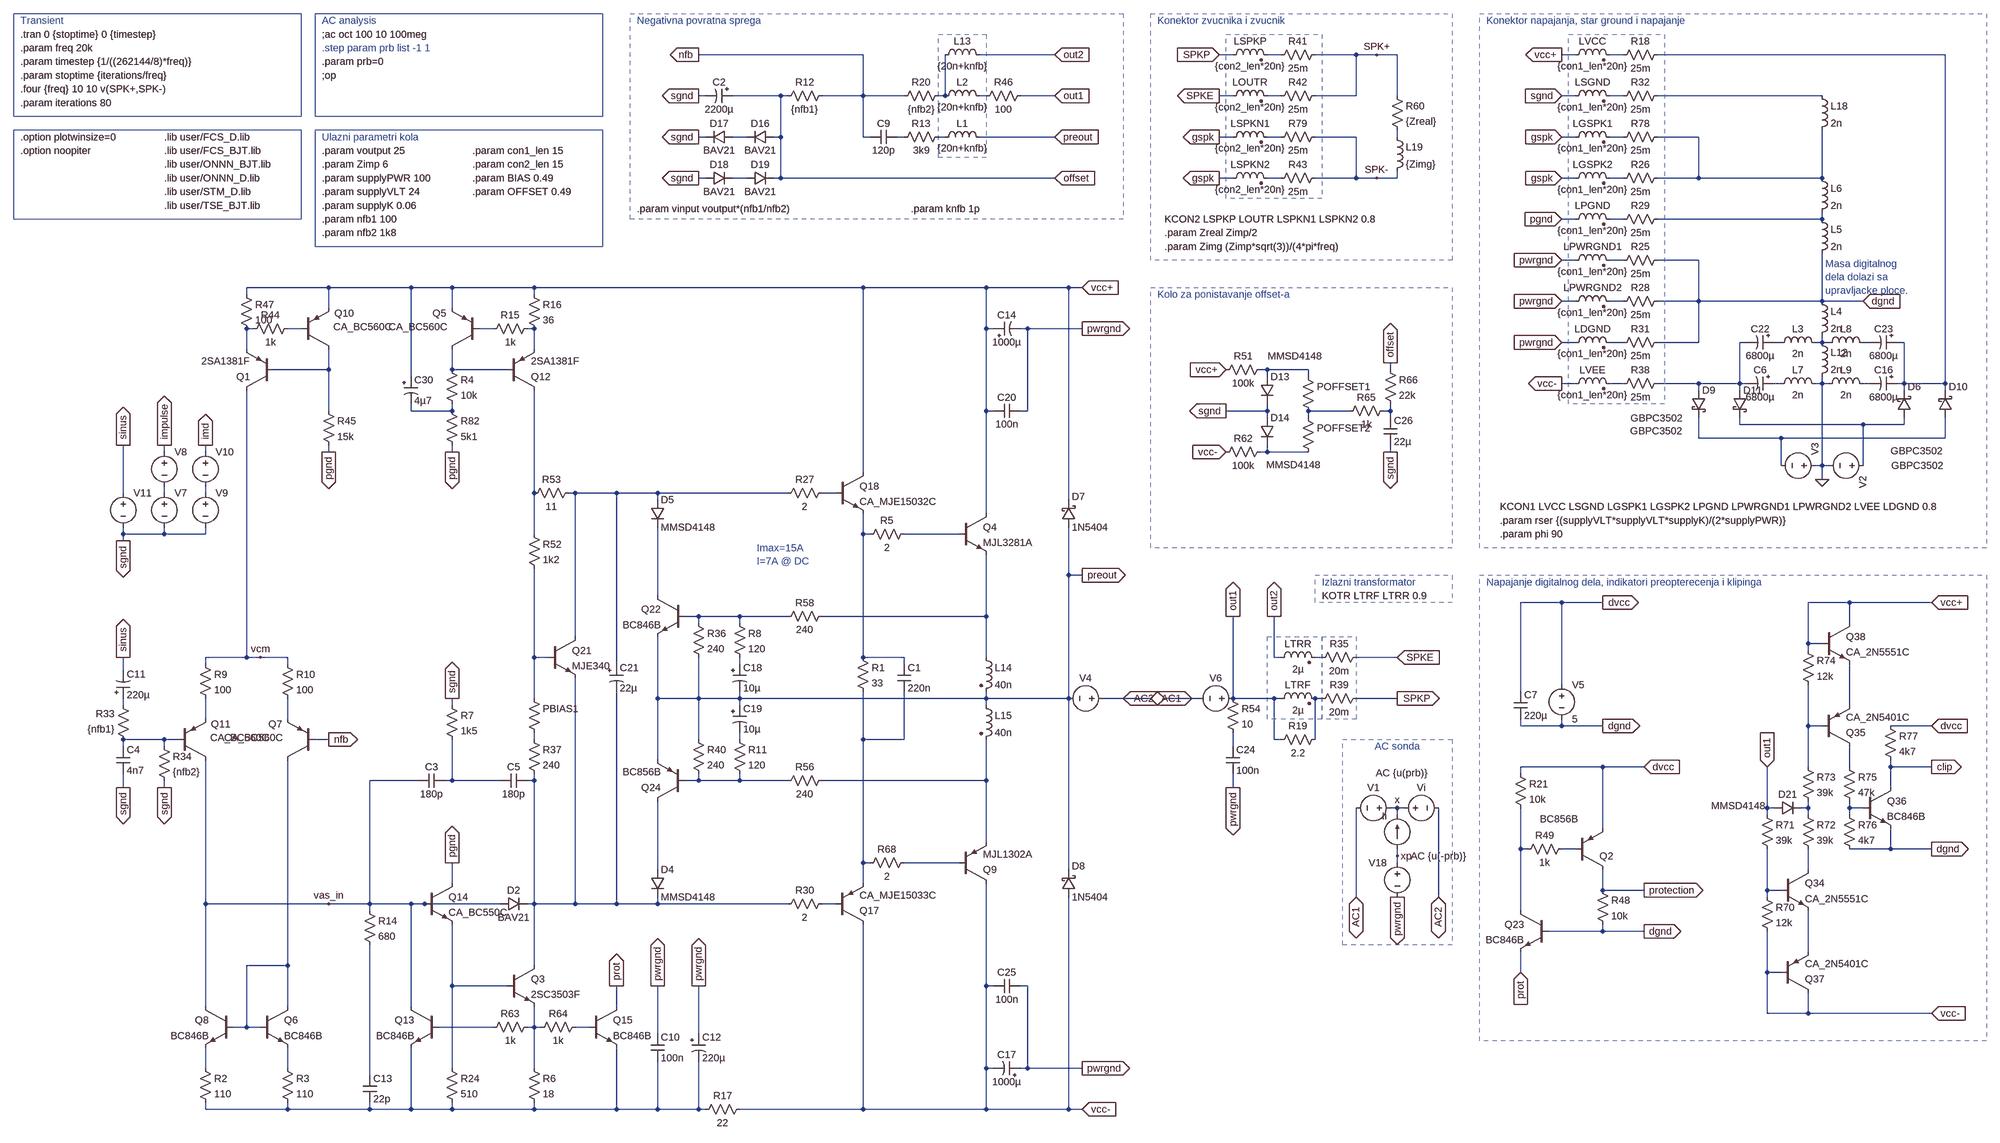
[diagram p0: schematic Arguo v2.asc]
Arguo v2.asc, the LTspice schematic file:
Version 4
SHEET 1 6124 2336
WIRE 1216 -1536 832 -1536
WIRE 1664 -1536 1488 -1536
WIRE 2080 -1536 2048 -1536
WIRE 2192 -1536 2160 -1536
WIRE 2368 -1536 2272 -1536
WIRE 2416 -1536 2368 -1536
WIRE 2464 -1536 2416 -1536
WIRE 2880 -1536 2848 -1536
WIRE 2992 -1536 2960 -1536
WIRE 3744 -1536 3072 -1536
WIRE 848 -1440 832 -1440
WIRE 1024 -1440 912 -1440
WIRE 1040 -1440 1024 -1440
WIRE 1216 -1440 1216 -1536
WIRE 1216 -1440 1120 -1440
WIRE 1312 -1440 1216 -1440
WIRE 1408 -1440 1408 -1536
WIRE 1408 -1440 1392 -1440
WIRE 1504 -1440 1488 -1440
WIRE 1664 -1440 1584 -1440
WIRE 2080 -1440 2048 -1440
WIRE 2192 -1440 2160 -1440
WIRE 2368 -1440 2368 -1536
WIRE 2368 -1440 2272 -1440
WIRE 2464 -1440 2464 -1536
WIRE 2880 -1440 2848 -1440
WIRE 2992 -1440 2960 -1440
WIRE 3456 -1440 3072 -1440
WIRE 848 -1344 832 -1344
WIRE 944 -1344 912 -1344
WIRE 1024 -1344 1024 -1440
WIRE 1024 -1344 1008 -1344
WIRE 1216 -1344 1216 -1440
WIRE 1232 -1344 1216 -1344
WIRE 1312 -1344 1296 -1344
WIRE 1408 -1344 1392 -1344
WIRE 1664 -1344 1488 -1344
WIRE 2080 -1344 2048 -1344
WIRE 2192 -1344 2160 -1344
WIRE 2368 -1344 2272 -1344
WIRE 2464 -1344 2464 -1360
WIRE 2880 -1344 2848 -1344
WIRE 2992 -1344 2960 -1344
WIRE 3168 -1344 3072 -1344
WIRE 848 -1248 832 -1248
WIRE 944 -1248 912 -1248
WIRE 1024 -1248 1024 -1344
WIRE 1024 -1248 1008 -1248
WIRE 1664 -1248 1024 -1248
WIRE 2080 -1248 2048 -1248
WIRE 2192 -1248 2160 -1248
WIRE 2368 -1248 2368 -1344
WIRE 2368 -1248 2272 -1248
WIRE 2416 -1248 2368 -1248
WIRE 2464 -1248 2464 -1264
WIRE 2464 -1248 2416 -1248
WIRE 2880 -1248 2848 -1248
WIRE 2992 -1248 2960 -1248
WIRE 3168 -1248 3168 -1344
WIRE 3168 -1248 3072 -1248
WIRE 3456 -1248 3456 -1360
WIRE 3456 -1248 3168 -1248
WIRE 2880 -1152 2848 -1152
WIRE 2992 -1152 2960 -1152
WIRE 3456 -1152 3456 -1168
WIRE 3456 -1152 3072 -1152
WIRE 2880 -1056 2848 -1056
WIRE 2992 -1056 2960 -1056
WIRE 3168 -1056 3072 -1056
WIRE -32 -992 -224 -992
WIRE 160 -992 -32 -992
WIRE 256 -992 160 -992
WIRE 448 -992 256 -992
WIRE 1216 -992 448 -992
WIRE 1344 -992 1216 -992
WIRE 1504 -992 1344 -992
WIRE 1696 -992 1504 -992
WIRE 1728 -992 1696 -992
WIRE -224 -976 -224 -992
WIRE 448 -976 448 -992
WIRE 2880 -960 2848 -960
WIRE 2992 -960 2960 -960
WIRE 3168 -960 3168 -1056
WIRE 3168 -960 3072 -960
WIRE 3456 -960 3456 -1072
WIRE 3456 -960 3168 -960
WIRE 3552 -960 3456 -960
WIRE -32 -944 -32 -992
WIRE 256 -944 256 -992
WIRE -208 -896 -224 -896
WIRE -96 -896 -128 -896
WIRE 352 -896 320 -896
WIRE 448 -896 432 -896
WIRE 1504 -896 1504 -992
WIRE 1520 -896 1504 -896
WIRE 1600 -896 1584 -896
WIRE 1728 -896 1600 -896
WIRE 2880 -864 2848 -864
WIRE 2992 -864 2960 -864
WIRE 3168 -864 3168 -960
WIRE 3168 -864 3072 -864
WIRE 3280 -864 3264 -864
WIRE 3360 -864 3344 -864
WIRE 3456 -864 3456 -880
WIRE 3456 -864 3440 -864
WIRE 3472 -864 3456 -864
WIRE 3568 -864 3552 -864
WIRE 3648 -864 3632 -864
WIRE -224 -848 -224 -896
WIRE 448 -848 448 -896
WIRE -32 -800 -32 -848
WIRE -32 -800 -160 -800
WIRE 256 -800 256 -848
WIRE 384 -800 256 -800
WIRE 2160 -800 2144 -800
WIRE 2256 -800 2160 -800
WIRE 2448 -800 2448 -816
WIRE 160 -784 160 -992
WIRE 2160 -784 2160 -800
WIRE 2256 -784 2256 -800
WIRE 2880 -768 2848 -768
WIRE 2992 -768 2960 -768
WIRE 3168 -768 3072 -768
WIRE 3264 -768 3264 -864
WIRE 3264 -768 3168 -768
WIRE 3280 -768 3264 -768
WIRE 3360 -768 3344 -768
WIRE 3456 -768 3456 -784
WIRE 3456 -768 3440 -768
WIRE 3472 -768 3456 -768
WIRE 3568 -768 3552 -768
WIRE 3648 -768 3648 -864
WIRE 3648 -768 3632 -768
WIRE 3744 -768 3744 -1536
WIRE 3744 -768 3648 -768
WIRE 3168 -752 3168 -768
WIRE 3264 -752 3264 -768
WIRE 3648 -752 3648 -768
WIRE 3744 -752 3744 -768
WIRE -32 -704 -32 -800
WIRE 160 -704 160 -720
WIRE 256 -704 256 -720
WIRE 256 -704 160 -704
WIRE 1504 -704 1504 -896
WIRE 1520 -704 1504 -704
WIRE 1600 -704 1600 -896
WIRE 1600 -704 1584 -704
WIRE 2160 -704 2160 -720
WIRE 2160 -704 2064 -704
WIRE 2352 -704 2256 -704
WIRE 2448 -704 2448 -720
WIRE 2448 -704 2432 -704
WIRE 2160 -688 2160 -704
WIRE 2256 -688 2256 -704
WIRE 2448 -688 2448 -704
WIRE 3264 -672 3264 -688
WIRE 3552 -672 3264 -672
WIRE 3648 -672 3648 -688
WIRE 3648 -672 3552 -672
WIRE 1216 -656 1216 -992
WIRE 3168 -640 3168 -688
WIRE 3360 -640 3168 -640
WIRE 3744 -640 3744 -688
WIRE 3744 -640 3360 -640
WIRE -416 -608 -416 -624
WIRE -320 -608 -320 -624
WIRE -224 -608 -224 -752
WIRE -32 -608 -32 -624
WIRE 256 -608 256 -624
WIRE 448 -608 448 -752
WIRE 2160 -608 2160 -624
WIRE 2160 -608 2144 -608
WIRE 2256 -608 2160 -608
WIRE 2448 -608 2448 -624
WIRE 3360 -576 3360 -640
WIRE 3456 -576 3456 -768
WIRE 3456 -576 3440 -576
WIRE 3472 -576 3456 -576
WIRE 3552 -576 3552 -672
WIRE 1216 -560 1216 -656
WIRE 3456 -544 3456 -576
WIRE -512 -512 -512 -624
WIRE -416 -512 -416 -528
WIRE -320 -512 -320 -528
WIRE 448 -512 448 -608
WIRE 544 -512 528 -512
WIRE 640 -512 544 -512
WIRE 736 -512 640 -512
WIRE 1040 -512 736 -512
WIRE 1152 -512 1120 -512
WIRE 736 -496 736 -512
WIRE 1696 -496 1696 -992
WIRE 1504 -464 1504 -704
WIRE -512 -416 -512 -432
WIRE -416 -416 -416 -432
WIRE -416 -416 -512 -416
WIRE -320 -416 -320 -432
WIRE -320 -416 -416 -416
WIRE 448 -416 448 -512
WIRE 1216 -416 1216 -464
WIRE 1232 -416 1216 -416
WIRE 1440 -416 1312 -416
WIRE -512 -400 -512 -416
WIRE 1696 -320 1696 -432
WIRE 1728 -320 1696 -320
WIRE 736 -272 736 -432
WIRE 2800 -256 2752 -256
WIRE 2848 -256 2800 -256
WIRE 2944 -256 2848 -256
WIRE 3520 -256 3424 -256
WIRE 3712 -256 3520 -256
WIRE 832 -224 800 -224
WIRE 928 -224 832 -224
WIRE 1040 -224 928 -224
WIRE 1504 -224 1504 -368
WIRE 1504 -224 1120 -224
WIRE 832 -208 832 -224
WIRE 928 -208 928 -224
WIRE 3520 -208 3520 -256
WIRE 544 -176 544 -512
WIRE 3424 -160 3424 -256
WIRE 3456 -160 3424 -160
WIRE 3424 -144 3424 -160
WIRE -224 -128 -224 -608
WIRE -224 -128 -320 -128
WIRE -192 -128 -224 -128
WIRE -128 -128 -192 -128
WIRE 448 -128 448 -336
WIRE 480 -128 448 -128
WIRE 1216 -128 1216 -416
WIRE 1312 -128 1216 -128
WIRE 1504 -128 1504 -224
WIRE 2176 -128 2176 -224
WIRE 2192 -128 2176 -128
WIRE 2288 -128 2272 -128
WIRE 2464 -128 2368 -128
WIRE -320 -112 -320 -128
WIRE -128 -112 -128 -128
WIRE 640 -112 640 -512
WIRE 928 -112 928 -128
WIRE 1312 -112 1312 -128
WIRE -512 -96 -512 -128
WIRE 2848 -64 2848 -256
WIRE 2752 -48 2752 -256
WIRE 448 -32 448 -128
WIRE 736 -32 736 -176
WIRE 832 -32 832 -128
WIRE 832 -32 736 -32
WIRE 928 -32 928 -48
WIRE 928 -32 832 -32
WIRE 1504 -32 1504 -48
WIRE 1504 -32 928 -32
WIRE 1632 -32 1504 -32
WIRE 1696 -32 1696 -320
WIRE 1696 -32 1632 -32
WIRE 1888 -32 1776 -32
WIRE 2000 -32 1920 -32
WIRE 2080 -32 2080 -224
WIRE 2176 -32 2080 -32
WIRE 2192 -32 2176 -32
WIRE 2288 -32 2272 -32
WIRE 2464 -32 2368 -32
WIRE -512 -16 -512 -32
WIRE 256 -16 256 -32
WIRE 928 -16 928 -32
WIRE 1504 -16 1504 -32
WIRE 3520 -16 3520 -112
WIRE -320 16 -320 -32
WIRE -128 16 -128 -32
WIRE 2752 32 2752 16
WIRE 2848 32 2848 16
WIRE 2848 32 2752 32
WIRE 2944 32 2848 32
WIRE 3424 32 3424 -64
WIRE 3456 32 3424 32
WIRE 3712 32 3616 32
WIRE -416 64 -512 64
WIRE -384 64 -416 64
WIRE -32 64 -64 64
WIRE 448 64 448 48
WIRE 832 64 832 -32
WIRE 928 64 928 48
WIRE 1216 64 1216 -48
WIRE 1312 64 1312 -48
WIRE 1312 64 1216 64
WIRE 2176 64 2176 -32
WIRE 2192 64 2176 64
WIRE 2272 64 2272 -32
WIRE -512 80 -512 64
WIRE -416 80 -416 64
WIRE 2080 80 2080 48
WIRE 736 112 736 -32
WIRE 2944 128 2752 128
WIRE 3040 128 2944 128
WIRE 3424 128 3424 32
WIRE 3520 128 3520 80
WIRE 3616 128 3616 112
WIRE 3712 128 3616 128
WIRE 2752 144 2752 128
WIRE 176 160 64 160
WIRE 256 160 256 64
WIRE 256 160 240 160
WIRE 368 160 256 160
WIRE 448 160 448 144
WIRE 448 160 432 160
WIRE 832 160 832 144
WIRE 832 160 800 160
WIRE 928 160 928 144
WIRE 928 160 832 160
WIRE 1040 160 928 160
WIRE 1504 160 1504 64
WIRE 1504 160 1120 160
WIRE -512 176 -512 144
WIRE -416 176 -416 160
WIRE 2080 176 2080 144
WIRE 3616 176 3616 128
WIRE 2464 224 2448 224
WIRE 2480 224 2464 224
WIRE 3328 224 3328 128
WIRE 3344 224 3328 224
WIRE 3424 224 3424 208
WIRE 3424 224 3408 224
WIRE 3520 224 3520 208
WIRE 3552 224 3520 224
WIRE 2464 240 2464 224
WIRE 3328 240 3328 224
WIRE 3424 240 3424 224
WIRE 3520 240 3520 224
WIRE 2944 272 2944 128
WIRE 1504 304 1504 160
WIRE 2752 320 2752 224
WIRE 2768 320 2752 320
WIRE 2880 320 2848 320
WIRE 3616 320 3616 272
WIRE 3616 320 3520 320
WIRE 3712 320 3616 320
WIRE 2464 336 2464 320
WIRE 1216 352 1216 64
WIRE 1232 352 1216 352
WIRE 1440 352 1312 352
WIRE 2464 352 2464 336
WIRE 736 368 736 208
WIRE 1696 368 1696 -32
WIRE 3424 368 3424 320
WIRE 256 400 256 352
WIRE 1216 400 1216 352
WIRE 2944 416 2944 368
WIRE 3040 416 2944 416
WIRE 3328 416 3328 320
WIRE 3360 416 3328 416
WIRE 2368 432 2368 224
WIRE 2560 432 2560 224
WIRE 3328 432 3328 416
WIRE -320 448 -320 112
WIRE -32 448 -320 448
WIRE 64 448 64 160
WIRE 64 448 -32 448
WIRE 160 448 64 448
WIRE 192 448 160 448
WIRE 368 448 192 448
WIRE 448 448 448 160
WIRE 448 448 432 448
WIRE 544 448 544 -80
WIRE 544 448 448 448
WIRE 640 448 640 -48
WIRE 640 448 544 448
WIRE 736 448 736 432
WIRE 736 448 640 448
WIRE 1040 448 736 448
WIRE 1152 448 1120 448
WIRE 64 464 64 448
WIRE 2752 464 2752 320
WIRE 2944 512 2944 496
WIRE 2944 512 2816 512
WIRE 3040 512 2944 512
WIRE 3424 560 3424 464
WIRE -128 592 -128 112
WIRE -128 592 -224 592
WIRE 448 592 448 448
WIRE 2752 608 2752 560
WIRE 3328 608 3328 512
WIRE 3360 608 3328 608
WIRE 256 640 256 496
WIRE 384 640 256 640
WIRE 1504 640 1504 400
WIRE 1520 640 1504 640
WIRE 1600 640 1584 640
WIRE -320 688 -320 448
WIRE -128 688 -128 592
WIRE 160 688 160 448
WIRE 640 688 640 640
WIRE 3328 704 3328 608
WIRE 3424 704 3424 656
WIRE 3424 704 3328 704
WIRE 3712 704 3424 704
WIRE -224 736 -224 592
WIRE -224 736 -256 736
WIRE -192 736 -224 736
WIRE 352 736 224 736
WIRE 448 736 448 688
WIRE 448 736 432 736
WIRE 464 736 448 736
WIRE 576 736 544 736
WIRE 736 752 736 640
WIRE 832 752 832 640
WIRE -320 832 -320 784
WIRE -128 832 -128 784
WIRE 256 832 256 640
WIRE 448 832 448 736
WIRE 1504 832 1504 640
WIRE 1520 832 1504 832
WIRE 1600 832 1600 640
WIRE 1600 832 1584 832
WIRE 1728 832 1600 832
WIRE 64 848 64 544
WIRE -320 928 -320 912
WIRE -128 928 -128 912
WIRE -128 928 -320 928
WIRE 64 928 64 912
WIRE 64 928 -128 928
WIRE 160 928 160 784
WIRE 160 928 64 928
WIRE 256 928 256 912
WIRE 256 928 160 928
WIRE 448 928 448 912
WIRE 448 928 256 928
WIRE 640 928 640 784
WIRE 640 928 448 928
WIRE 736 928 736 816
WIRE 736 928 640 928
WIRE 832 928 832 816
WIRE 832 928 736 928
WIRE 848 928 832 928
WIRE 1216 928 1216 496
WIRE 1216 928 928 928
WIRE 1344 928 1216 928
WIRE 1504 928 1504 832
WIRE 1504 928 1344 928
WIRE 1696 928 1696 432
WIRE 1696 928 1504 928
WIRE 1728 928 1696 928
FLAG 1728 -992 vcc+
IOPIN 1728 -992 In
FLAG 2464 224 x
FLAG 1728 928 vcc-
IOPIN 1728 928 In
FLAG 2080 -224 out1
IOPIN 2080 -224 Out
FLAG 832 -1536 nfb
IOPIN 832 -1536 Out
FLAG -32 64 nfb
IOPIN -32 64 Out
FLAG 2464 336 xp
FLAG 2080 176 pwrgnd
IOPIN 2080 176 Out
FLAG -512 176 sgnd
IOPIN -512 176 Out
FLAG -416 176 sgnd
IOPIN -416 176 Out
FLAG 832 -1440 sgnd
IOPIN 832 -1440 Out
FLAG 1728 -896 pwrgnd
IOPIN 1728 -896 Out
FLAG 2752 608 prot
IOPIN 2752 608 In
FLAG 3040 512 dgnd
IOPIN 3040 512 Out
FLAG 3040 128 dvcc
IOPIN 3040 128 In
FLAG 3040 416 protection
IOPIN 3040 416 Out
FLAG 1728 -320 preout
IOPIN 1728 -320 Out
FLAG -192 -128 vcm
FLAG 832 -1344 sgnd
IOPIN 832 -1344 Out
FLAG 832 -1248 sgnd
IOPIN 832 -1248 Out
FLAG 2176 -224 out2
IOPIN 2176 -224 Out
FLAG 3712 128 clip
IOPIN 3712 128 Out
FLAG 3712 320 dgnd
IOPIN 3712 320 Out
FLAG 3712 32 dvcc
IOPIN 3712 32 In
FLAG -512 -400 sgnd
IOPIN -512 -400 Out
FLAG -512 -624 sinus
IOPIN -512 -624 Out
FLAG 640 640 prot
IOPIN 640 640 Out
FLAG 832 640 pwrgnd
IOPIN 832 640 Out
FLAG 256 352 pgnd
IOPIN 256 352 Out
FLAG -32 -608 pgnd
IOPIN -32 -608 Out
FLAG 256 -608 pgnd
IOPIN 256 -608 Out
FLAG 1728 832 pwrgnd
IOPIN 1728 832 Out
FLAG 2848 -1536 vcc+
IOPIN 2848 -1536 Out
FLAG 2848 -768 vcc-
IOPIN 2848 -768 Out
FLAG 2848 -1248 gspk
IOPIN 2848 -1248 In
FLAG 2848 -960 pwrgnd
IOPIN 2848 -960 In
FLAG 2848 -1152 pgnd
IOPIN 2848 -1152 In
FLAG 2848 -1440 sgnd
IOPIN 2848 -1440 In
FLAG 1664 -1440 out1
IOPIN 1664 -1440 In
FLAG 1664 -1536 out2
IOPIN 1664 -1536 In
FLAG 2464 -32 SPKP
IOPIN 2464 -32 Out
FLAG 2048 -1248 gspk
IOPIN 2048 -1248 Out
FLAG 2048 -1536 SPKP
IOPIN 2048 -1536 In
FLAG 2048 -1440 SPKE
IOPIN 2048 -1440 Out
FLAG 3328 128 out1
IOPIN 3328 128 In
FLAG 3552 -960 dgnd
IOPIN 3552 -960 In
FLAG 3712 704 vcc-
IOPIN 3712 704 In
FLAG 3712 -256 vcc+
IOPIN 3712 -256 In
FLAG 2944 -256 dvcc
IOPIN 2944 -256 Out
FLAG 2944 32 dgnd
IOPIN 2944 32 Out
FLAG 2848 -1056 pwrgnd
IOPIN 2848 -1056 In
FLAG 736 640 pwrgnd
IOPIN 736 640 Out
FLAG -416 -624 impulse
IOPIN -416 -624 Out
FLAG 2848 -864 pwrgnd
IOPIN 2848 -864 In
FLAG 3456 -544 0
FLAG 2064 -800 vcc+
IOPIN 2064 -800 In
FLAG 2064 -608 vcc-
IOPIN 2064 -608 In
FLAG 2064 -704 sgnd
IOPIN 2064 -704 Out
FLAG 2448 -608 sgnd
IOPIN 2448 -608 Out
FLAG 2448 -816 offset
IOPIN 2448 -816 Out
FLAG 1664 -1248 offset
IOPIN 1664 -1248 In
FLAG 2368 432 AC1
IOPIN 2368 432 BiDir
FLAG 2560 432 AC2
IOPIN 2560 432 BiDir
FLAG 1888 -32 AC1
IOPIN 1888 -32 BiDir
FLAG 1920 -32 AC2
IOPIN 1920 -32 BiDir
FLAG 2464 432 pwrgnd
IOPIN 2464 432 Out
FLAG 2416 -1536 SPK+
FLAG 2416 -1248 SPK-
FLAG 2464 -128 SPKE
IOPIN 2464 -128 In
FLAG 2848 -1344 gspk
IOPIN 2848 -1344 In
FLAG 2048 -1344 gspk
IOPIN 2048 -1344 Out
FLAG -320 -624 imd
IOPIN -320 -624 Out
FLAG 256 -32 sgnd
IOPIN 256 -32 Out
FLAG 1664 -1344 preout
IOPIN 1664 -1344 In
FLAG -32 448 vas_in
FLAG -512 -128 sinus
IOPIN -512 -128 Out
DATAFLAG 448 -608 "-Ic(Q12)"
DATAFLAG 2800 -256 ""
DATAFLAG 1504 -32 ""
DATAFLAG 1344 -992 ""
DATAFLAG 1344 928 ""
DATAFLAG 1216 -656 "Ic(Q18)"
DATAFLAG -224 -608 "-Ic(Q1)"
DATAFLAG 1632 -32 ""
SYMBOL res 1136 -1456 R90
WINDOW 0 0 56 VBottom 2
WINDOW 3 32 56 VTop 2
SYMATTR InstName R12
SYMATTR Value {nfb1}
SYMBOL voltage 3568 -576 R90
WINDOW 123 0 0 Left 2
WINDOW 3 -94 177 Invisible 2
SYMATTR Value SINE(0 {supplyVLT*sqrt(2)} 50 0 0 {phi})
SYMATTR SpiceLine Rser={rser}
SYMATTR InstName V2
SYMBOL current 2464 320 R180
WINDOW 0 24 77 Left 2
WINDOW 3 24 0 Invisible 2
WINDOW 123 -71 178 Left 2
WINDOW 39 0 0 Left 2
SYMATTR InstName Ii
SYMATTR Value 0
SYMATTR Value2 AC {u(prb)}
SYMBOL voltage 2464 224 R270
WINDOW 0 32 56 VTop 2
WINDOW 3 -32 56 Invisible 2
WINDOW 123 -97 96 VBottom 2
WINDOW 39 -32 56 VBottom 2
SYMATTR InstName Vi
SYMATTR Value 0
SYMATTR Value2 AC {u(-prb)}
SYMBOL pnp -384 112 M180
WINDOW 0 77 84 Left 2
WINDOW 3 75 52 Left 2
SYMATTR InstName Q11
SYMATTR Value CA_BC560C
SYMBOL res -496 80 R180
WINDOW 0 36 76 Left 2
WINDOW 3 36 40 Left 2
SYMATTR InstName R33
SYMATTR Value {nfb1}
SYMBOL res -432 64 R0
SYMATTR InstName R34
SYMATTR Value {nfb2}
SYMBOL res -336 816 R0
SYMATTR InstName R2
SYMATTR Value 110
SYMBOL res -144 816 R0
SYMATTR InstName R3
SYMATTR Value 110
SYMBOL res -336 -128 R0
SYMATTR InstName R9
SYMATTR Value 100
SYMBOL res -144 -128 R0
SYMATTR InstName R10
SYMATTR Value 100
SYMBOL res 432 -992 R0
SYMATTR InstName R16
SYMATTR Value 36
SYMBOL pnp 384 -752 M180
SYMATTR InstName Q12
SYMATTR Value 2SA1381F
SYMBOL schottky 1680 -432 M180
WINDOW 0 24 72 Left 2
WINDOW 3 24 0 Left 2
SYMATTR InstName D7
SYMATTR Value 1N5404
SYMATTR Description Diode
SYMATTR Type diode
SYMBOL schottky 1680 432 M180
WINDOW 0 24 72 Left 2
WINDOW 3 24 0 Left 2
SYMATTR InstName D8
SYMATTR Value 1N5404
SYMATTR Description Diode
SYMATTR Type diode
SYMBOL ind2 2176 -16 R270
WINDOW 0 32 56 VTop 2
WINDOW 3 4 56 VBottom 2
SYMATTR InstName LTRF
SYMATTR Value 2µ
SYMATTR SpiceLine Rser=10m Rpar=3meg Cpar=1p
SYMATTR Type ind
SYMBOL res 2176 80 R270
WINDOW 0 32 56 VTop 2
WINDOW 3 0 56 VBottom 2
SYMATTR InstName R19
SYMATTR Value 2.2
SYMBOL res 1408 -1456 R90
WINDOW 0 0 56 VBottom 2
WINDOW 3 32 56 VTop 2
SYMATTR InstName R20
SYMATTR Value {nfb2}
SYMBOL voltage 2464 224 R90
WINDOW 0 -32 56 VBottom 2
WINDOW 3 32 56 Invisible 2
WINDOW 123 0 0 Left 2
WINDOW 39 0 0 Left 2
SYMATTR InstName V1
SYMATTR Value 0
SYMBOL schottky 3632 -688 M180
WINDOW 0 24 72 Left 2
WINDOW 3 -14 -112 Left 2
SYMATTR InstName D6
SYMATTR Value GBPC3502
SYMATTR Description Diode
SYMATTR Type diode
SYMBOL schottky 3152 -752 R0
WINDOW 3 -144 95 Left 2
SYMATTR Value GBPC3502
SYMATTR InstName D9
SYMATTR Description Diode
SYMATTR Type diode
SYMBOL voltage 3456 -576 M270
WINDOW 123 0 0 Left 2
WINDOW 3 -96 -62 Invisible 2
SYMATTR Value SINE(0 {supplyVLT*sqrt(2)} 50 0 0 {phi})
SYMATTR SpiceLine Rser={rser}
SYMATTR InstName V3
SYMBOL res 2064 -48 R0
SYMATTR InstName R54
SYMATTR Value 10
SYMBOL res 2448 -1456 R0
SYMATTR InstName R60
SYMATTR Value {Zreal}
SYMBOL ind 2448 -1360 R0
SYMATTR InstName L19
SYMATTR Value {Zimg}
SYMATTR SpiceLine Cpar=10p
SYMBOL voltage 2464 336 M0
WINDOW 123 0 0 Left 2
WINDOW 39 0 0 Left 2
WINDOW 3 24 96 Invisible 2
SYMATTR Value 0
SYMATTR InstName V18
SYMBOL pnp 1152 496 M180
SYMATTR InstName Q17
SYMATTR Value CA_MJE15033C
SYMBOL npn 1152 -560 R0
SYMATTR InstName Q18
SYMATTR Value CA_MJE15032C
SYMBOL cap 1520 -720 M90
WINDOW 0 0 32 VBottom 2
WINDOW 3 32 32 VTop 2
SYMATTR InstName C20
SYMATTR Value 100n
SYMATTR SpiceLine Rser=700m Lser=7n Rpar=4.4meg Cpar=1p
SYMBOL res 1136 -528 R90
WINDOW 0 0 56 VBottom 2
WINDOW 3 32 56 VTop 2
SYMATTR InstName R27
SYMATTR Value 2
SYMBOL res 1136 432 R90
WINDOW 0 0 56 VBottom 2
WINDOW 3 32 56 VTop 2
SYMATTR InstName R30
SYMATTR Value 2
SYMBOL res 240 816 R0
SYMATTR InstName R24
SYMATTR Value 510
SYMBOL cap 2064 80 R0
SYMATTR InstName C24
SYMATTR Value 100n
SYMATTR SpiceLine Rser=700m Lser=7n Rpar=4.4meg Cpar=1p
SYMBOL cap 1584 624 R90
WINDOW 0 0 32 VBottom 2
WINDOW 3 32 32 VTop 2
SYMATTR InstName C25
SYMATTR Value 100n
SYMATTR SpiceLine Rser=700m Lser=7n Rpar=4.4meg Cpar=1p
SYMBOL polcap 912 -1456 R90
WINDOW 0 0 32 VBottom 2
WINDOW 3 32 32 VTop 2
SYMATTR InstName C2
SYMATTR Value 2200µ
SYMATTR SpiceLine V=6.3 Irms=1.44 Rser=0.09 Lser=5.5n Rpar=110k Cpar=3p mfg="Nichicon" pn="UPW0J222MPD6TD" type="Al electrolytic"
SYMATTR Description Capacitor
SYMATTR Type cap
SYMBOL polcap 3344 -784 R90
WINDOW 0 0 32 VBottom 2
WINDOW 3 32 32 VTop 2
SYMATTR InstName C6
SYMATTR Value 6800µ
SYMATTR SpiceLine V=50 Irms=2.5 Rser=0.08 Lser=20n Rpar=40k Cpar=3p mfg="Nichicon" pn="UVZ1H682MRD" type="Al electrolytic"
SYMATTR Description Capacitor
SYMATTR Type cap
SYMBOL res 2736 128 R0
SYMATTR InstName R21
SYMATTR Value 10k
SYMBOL npn 2816 464 M0
SYMATTR InstName Q23
SYMATTR Value BC846B
SYMBOL res -240 -992 R0
SYMATTR InstName R47
SYMATTR Value 100
SYMBOL pnp 2880 368 M180
WINDOW 3 -83 118 Left 2
SYMATTR Value BC856B
SYMATTR InstName Q2
SYMBOL res 2928 400 R0
SYMATTR InstName R48
SYMATTR Value 10k
SYMBOL res 2864 304 R90
WINDOW 0 0 56 VBottom 2
WINDOW 3 32 56 VTop 2
SYMATTR InstName R49
SYMATTR Value 1k
SYMBOL res 432 -48 R0
WINDOW 3 36 76 Invisible 2
SYMATTR Value {1+(500*BIAS)}
SYMATTR InstName PBIAS1
SYMBOL res 432 -432 R0
SYMATTR InstName R52
SYMATTR Value 1k2
SYMBOL res 544 -528 R90
WINDOW 0 0 56 VBottom 2
WINDOW 3 32 56 VTop 2
SYMATTR InstName R53
SYMATTR Value 11
SYMBOL schottky 3728 -688 M180
WINDOW 0 24 72 Left 2
WINDOW 3 -112 -78 Left 2
SYMATTR InstName D10
SYMATTR Value GBPC3502
SYMATTR Description Diode
SYMATTR Type diode
SYMBOL schottky 3248 -752 R0
WINDOW 3 -239 65 Left 2
SYMATTR Value GBPC3502
SYMATTR InstName D11
SYMATTR Description Diode
SYMATTR Type diode
SYMBOL ind2 2864 -1520 R270
WINDOW 0 32 56 VTop 2
WINDOW 3 5 56 VBottom 2
SYMATTR InstName LVCC
SYMATTR Value {con1_len*20n}
SYMATTR SpiceLine Rser={con1_len*.5m}
SYMATTR Type ind
SYMBOL ind2 2864 -752 R270
WINDOW 0 32 56 VTop 2
WINDOW 3 5 56 VBottom 2
SYMATTR InstName LVEE
SYMATTR Value {con1_len*20n}
SYMATTR SpiceLine Rser={con1_len*.5m}
SYMATTR Type ind
SYMBOL diode 368 464 R270
WINDOW 0 32 32 VTop 2
WINDOW 3 0 32 VBottom 2
SYMATTR InstName D2
SYMATTR Value BAV21
SYMBOL diode 1008 -1360 R90
WINDOW 0 0 32 VBottom 2
WINDOW 3 32 32 VTop 2
SYMATTR InstName D16
SYMATTR Value BAV21
SYMBOL diode 912 -1360 R90
WINDOW 0 0 32 VBottom 2
WINDOW 3 32 32 VTop 2
SYMATTR InstName D17
SYMATTR Value BAV21
SYMBOL diode 848 -1232 R270
WINDOW 0 32 32 VTop 2
WINDOW 3 0 32 VBottom 2
SYMATTR InstName D18
SYMATTR Value BAV21
SYMBOL diode 944 -1232 R270
WINDOW 0 32 32 VTop 2
WINDOW 3 0 32 VBottom 2
SYMATTR InstName D19
SYMATTR Value BAV21
SYMBOL res 1600 -1456 R90
WINDOW 0 0 56 VBottom 2
WINDOW 3 32 56 VTop 2
SYMATTR InstName R46
SYMATTR Value 100
SYMBOL ind2 2176 -112 R270
WINDOW 0 32 56 VTop 2
WINDOW 3 4 56 VBottom 2
SYMATTR InstName LTRR
SYMATTR Value 2µ
SYMATTR SpiceLine Rser=80m Rpar=3meg Cpar=1p
SYMATTR Type ind
SYMBOL npn 3360 368 R0
SYMATTR InstName Q34
SYMATTR Value CA_2N5551C
SYMBOL res 3312 416 R0
SYMATTR InstName R70
SYMATTR Value 12k
SYMBOL res 3312 224 R0
SYMATTR InstName R71
SYMATTR Value 39k
SYMBOL res 3408 224 R0
SYMATTR InstName R72
SYMATTR Value 39k
SYMBOL diode 3344 240 R270
WINDOW 0 32 32 VTop 2
WINDOW 3 37 -83 VBottom 2
SYMATTR InstName D21
SYMATTR Value MMSD4148
SYMBOL res 3408 112 R0
SYMATTR InstName R73
SYMATTR Value 39k
SYMBOL res 3408 -160 R0
SYMATTR InstName R74
SYMATTR Value 12k
SYMBOL pnp 3456 80 M180
SYMATTR InstName Q35
SYMATTR Value CA_2N5401C
SYMBOL res 3504 112 R0
SYMATTR InstName R75
SYMATTR Value 47k
SYMBOL npn 3552 176 R0
SYMATTR InstName Q36
SYMATTR Value BC846B
SYMBOL res 3504 224 R0
SYMATTR InstName R76
SYMATTR Value 4k7
SYMBOL res 3600 16 R0
SYMATTR InstName R77
SYMATTR Value 4k7
SYMBOL pnp 3360 656 M180
SYMATTR InstName Q37
SYMATTR Value CA_2N5401C
SYMBOL npn 3456 -208 R0
SYMATTR InstName Q38
SYMATTR Value CA_2N5551C
SYMBOL npn 384 592 R0
SYMATTR InstName Q3
SYMATTR Value 2SC3503F
SYMBOL res 432 816 R0
SYMATTR InstName R6
SYMATTR Value 18
SYMBOL cap -528 144 M180
WINDOW 0 24 56 Left 2
WINDOW 3 24 8 Left 2
SYMATTR InstName C4
SYMATTR Value 4n7
SYMBOL voltage -512 -528 R0
WINDOW 123 24 44 Left 2
WINDOW 39 0 0 Left 2
WINDOW 3 24 96 Invisible 2
SYMATTR Value SINE(0 {vinput} {freq})
SYMATTR InstName V11
SYMBOL npn 224 688 M0
SYMATTR InstName Q13
SYMATTR Value BC846B
SYMBOL res 448 720 R90
WINDOW 0 0 56 VBottom 2
WINDOW 3 32 56 VTop 2
SYMATTR InstName R63
SYMATTR Value 1k
SYMBOL res 560 720 R90
WINDOW 0 0 56 VBottom 2
WINDOW 3 32 56 VTop 2
SYMATTR InstName R64
SYMATTR Value 1k
SYMBOL res 240 -816 R0
SYMATTR InstName R4
SYMATTR Value 10k
SYMBOL res 1200 -144 R0
SYMATTR InstName R1
SYMATTR Value 33
SYMBOL pnp -160 -752 R180
SYMATTR InstName Q1
SYMATTR Value 2SA1381F
SYMBOL pnp -64 112 R180
WINDOW 0 77 84 Left 2
WINDOW 3 75 52 Left 2
SYMATTR InstName Q7
SYMATTR Value CA_BC560C
SYMBOL npn 480 -176 R0
SYMATTR InstName Q21
SYMATTR Value MJE340
SYMBOL cap 1296 -112 R0
SYMATTR InstName C1
SYMATTR Value 220n
SYMATTR SpiceLine Rser=30m Lser=3n Rpar=700k
SYMBOL cap 432 144 R90
WINDOW 0 0 32 VBottom 2
WINDOW 3 32 32 VTop 2
SYMATTR InstName C5
SYMATTR Value 180p
SYMATTR SpiceLine Rser=140m Lser=3n Rpar=7.4meg
SYMBOL res 944 912 R90
WINDOW 0 0 56 VBottom 2
WINDOW 3 32 56 VTop 2
SYMATTR InstName R17
SYMATTR Value 22
SYMBOL ind2 2864 -1232 R270
WINDOW 0 32 56 VTop 2
WINDOW 3 5 56 VBottom 2
SYMATTR InstName LGSPK2
SYMATTR Value {con1_len*20n}
SYMATTR SpiceLine Rser={con1_len*.5m}
SYMATTR Type ind
SYMBOL ind2 2864 -944 R270
WINDOW 0 32 56 VTop 2
WINDOW 3 5 56 VBottom 2
SYMATTR InstName LPWRGND2
SYMATTR Value {con1_len*20n}
SYMATTR SpiceLine Rser={con1_len*.5m}
SYMATTR Type ind
SYMBOL ind2 2864 -1136 R270
WINDOW 0 32 56 VTop 2
WINDOW 3 5 56 VBottom 2
SYMATTR InstName LPGND
SYMATTR Value {con1_len*20n}
SYMATTR SpiceLine Rser={con1_len*.5m}
SYMATTR Type ind
SYMBOL ind2 2864 -1424 R270
WINDOW 0 32 56 VTop 2
WINDOW 3 5 56 VBottom 2
SYMATTR InstName LSGND
SYMATTR Value {con1_len*20n}
SYMATTR SpiceLine Rser={con1_len*.5m}
SYMATTR Type ind
SYMBOL res 3088 -1552 R90
WINDOW 0 0 56 VBottom 2
WINDOW 3 32 56 VTop 2
SYMATTR InstName R18
SYMATTR Value 25m
SYMBOL res 3088 -1264 R90
WINDOW 0 0 56 VBottom 2
WINDOW 3 32 56 VTop 2
SYMATTR InstName R26
SYMATTR Value 25m
SYMBOL res 3088 -976 R90
WINDOW 0 0 56 VBottom 2
WINDOW 3 32 56 VTop 2
SYMATTR InstName R28
SYMATTR Value 25m
SYMBOL res 3088 -1168 R90
WINDOW 0 0 56 VBottom 2
WINDOW 3 32 56 VTop 2
SYMATTR InstName R29
SYMATTR Value 25m
SYMBOL res 3088 -1456 R90
WINDOW 0 0 56 VBottom 2
WINDOW 3 32 56 VTop 2
SYMATTR InstName R32
SYMATTR Value 25m
SYMBOL res 3088 -784 R90
WINDOW 0 0 56 VBottom 2
WINDOW 3 32 56 VTop 2
SYMATTR InstName R38
SYMATTR Value 25m
SYMBOL ind 3440 -976 R0
SYMATTR InstName L4
SYMATTR Value 2n
SYMATTR SpiceLine Rser=1m
SYMBOL ind 3440 -1168 R0
SYMATTR InstName L5
SYMATTR Value 2n
SYMATTR SpiceLine Rser=1m
SYMBOL ind 3440 -1264 R0
SYMATTR InstName L6
SYMATTR Value 2n
SYMATTR SpiceLine Rser=1m
SYMBOL ind 3440 -1456 R0
SYMATTR InstName L18
SYMATTR Value 2n
SYMATTR SpiceLine Rser=1m
SYMBOL ind2 2064 -1520 R270
WINDOW 0 32 56 VTop 2
WINDOW 3 5 56 VBottom 2
SYMATTR InstName LSPKP
SYMATTR Value {con2_len*20n}
SYMATTR SpiceLine Rser={con2_len*.5m}
SYMATTR Type ind
SYMBOL ind2 2064 -1424 R270
WINDOW 0 32 56 VTop 2
WINDOW 3 5 56 VBottom 2
SYMATTR InstName LOUTR
SYMATTR Value {con2_len*20n}
SYMATTR SpiceLine Rser={con2_len*.5m}
SYMATTR Type ind
SYMBOL ind2 2064 -1232 R270
WINDOW 0 32 56 VTop 2
WINDOW 3 5 56 VBottom 2
SYMATTR InstName LSPKN2
SYMATTR Value {con2_len*20n}
SYMATTR SpiceLine Rser={con2_len*.5m}
SYMATTR Type ind
SYMBOL res 2384 -144 R90
WINDOW 0 0 56 VBottom 2
WINDOW 3 32 56 VTop 2
SYMATTR InstName R35
SYMATTR Value 20m
SYMBOL res 2384 -48 R90
WINDOW 0 0 56 VBottom 2
WINDOW 3 32 56 VTop 2
SYMATTR InstName R39
SYMATTR Value 20m
SYMBOL res 2288 -1552 R90
WINDOW 0 0 56 VBottom 2
WINDOW 3 32 56 VTop 2
SYMATTR InstName R41
SYMATTR Value 25m
SYMBOL res 2288 -1456 R90
WINDOW 0 0 56 VBottom 2
WINDOW 3 32 56 VTop 2
SYMATTR InstName R42
SYMATTR Value 25m
SYMBOL res 2288 -1264 R90
WINDOW 0 0 56 VBottom 2
WINDOW 3 32 56 VTop 2
SYMATTR InstName R43
SYMATTR Value 25m
SYMBOL ind2 2864 -848 R270
WINDOW 0 32 56 VTop 2
WINDOW 3 5 56 VBottom 2
SYMATTR InstName LDGND
SYMATTR Value {con1_len*20n}
SYMATTR SpiceLine Rser={con1_len*.5m}
SYMATTR Type ind
SYMBOL res 3088 -880 R90
WINDOW 0 0 56 VBottom 2
WINDOW 3 32 56 VTop 2
SYMATTR InstName R31
SYMATTR Value 25m
SYMBOL cap 2736 -48 R0
SYMATTR InstName C7
SYMATTR Value 220µ
SYMATTR SpiceLine Rser=100m Lser=50n Rpar=100k Cpar=3p
SYMBOL voltage 2848 -80 R0
WINDOW 123 0 0 Left 2
SYMATTR InstName V5
SYMATTR Value 5
SYMATTR SpiceLine Rser=10
SYMBOL ind2 2864 -1040 R270
WINDOW 0 32 56 VTop 2
WINDOW 3 5 56 VBottom 2
SYMATTR InstName LPWRGND1
SYMATTR Value {con1_len*20n}
SYMATTR SpiceLine Rser={con1_len*.5m}
SYMATTR Type ind
SYMBOL res 3088 -1072 R90
WINDOW 0 0 56 VBottom 2
WINDOW 3 32 56 VTop 2
SYMATTR InstName R25
SYMATTR Value 25m
SYMBOL cap 720 752 R0
SYMATTR InstName C10
SYMATTR Value 100n
SYMATTR SpiceLine Rser=700m Lser=7n Rpar=4.4meg Cpar=1p
SYMBOL voltage -416 -528 R0
WINDOW 3 24 96 Invisible 2
WINDOW 123 0 0 Left 2
WINDOW 39 0 0 Left 2
SYMATTR Value PULSE(0 {vinput/2} 1u 1n 1n {1/(freq*2)} {1/freq})
SYMATTR InstName V7
SYMBOL voltage -416 -624 R0
WINDOW 3 24 96 Invisible 2
WINDOW 123 0 0 Left 2
WINDOW 39 0 0 Left 2
SYMATTR Value PULSE(0 {-vinput/2} {1u+(1/(freq*2))} 1n 1n {1/(freq*2)} {1/freq})
SYMATTR InstName V8
SYMBOL npn 800 -272 M0
SYMATTR InstName Q22
SYMATTR Value BC846B
SYMBOL pnp 800 208 R180
SYMATTR InstName Q24
SYMATTR Value BC856B
SYMBOL diode 720 368 R0
SYMATTR InstName D4
SYMATTR Value MMSD4148
SYMBOL diode 720 -496 R0
SYMATTR InstName D5
SYMATTR Value MMSD4148
SYMBOL res 816 -224 R0
SYMATTR InstName R36
SYMATTR Value 240
SYMBOL res 816 48 R0
SYMATTR InstName R40
SYMATTR Value 240
SYMBOL res 1136 144 R90
WINDOW 0 0 56 VBottom 2
WINDOW 3 32 56 VTop 2
SYMATTR InstName R56
SYMATTR Value 240
SYMBOL res 1136 -240 R90
WINDOW 0 0 56 VBottom 2
WINDOW 3 32 56 VTop 2
SYMATTR InstName R58
SYMATTR Value 240
SYMBOL polcap 912 -112 R0
SYMATTR InstName C18
SYMATTR Value 10µ
SYMATTR SpiceLine V=100 Irms=250m Rser=0.71 Lser=2n Rpar=2meg Cpar=2p
SYMATTR Description Capacitor
SYMATTR Type cap
SYMBOL polcap -528 -32 M180
WINDOW 3 24 8 Left 2
WINDOW 0 24 57 Left 2
SYMATTR Value 220µ
SYMATTR InstName C11
SYMATTR SpiceLine V=6.3 Irms=290m Rser=0.5 Lser=3n Rpar=100k Cpar=3p mfg="Nichicon" pn="UPW0J221MED1TD" type="Al electrolytic"
SYMATTR Description Capacitor
SYMATTR Type cap
SYMBOL polcap 816 752 R0
SYMATTR Value 220µ
SYMATTR InstName C12
SYMATTR SpiceLine V=6.3 Irms=290m Rser=0.5 Lser=3n Rpar=100k Cpar=3p mfg="Nichicon" pn="UPW0J221MED1TD" type="Al electrolytic"
SYMATTR Description Capacitor
SYMATTR Type cap
SYMBOL polcap 1520 -880 R270
WINDOW 0 32 32 VTop 2
WINDOW 3 0 32 VBottom 2
SYMATTR InstName C14
SYMATTR Value 1000µ
SYMATTR SpiceLine V=63 Irms=2.77 Rser=0.036 Lser=5n Rpar=100k Cpar=3p mfg="Nichicon" pn="UPW1J102MHD6" type="Al electrolytic"
SYMATTR Description Capacitor
SYMATTR Type cap
SYMBOL polcap 1584 848 M270
WINDOW 0 32 32 VTop 2
WINDOW 3 0 32 VBottom 2
SYMATTR InstName C17
SYMATTR Value 1000µ
SYMATTR SpiceLine V=63 Irms=2.77 Rser=0.036 Lser=5n Rpar=100k Cpar=3p mfg="Nichicon" pn="UPW1J102MHD6" type="Al electrolytic"
SYMATTR Description Capacitor
SYMATTR Type cap
SYMBOL polcap 624 -112 R0
SYMATTR InstName C21
SYMATTR Value 22µ
SYMATTR SpiceLine V=100 Irms=250m Rser=0.71 Lser=2n Rpar=2meg Cpar=2p mfg="Nichicon" pn="UPW1J220MED" type="Al electrolytic"
SYMATTR Description Capacitor
SYMATTR Type cap
SYMBOL polcap 3632 -784 R90
WINDOW 0 0 32 VBottom 2
WINDOW 3 32 32 VTop 2
SYMATTR InstName C16
SYMATTR Value 6800µ
SYMATTR SpiceLine V=50 Irms=2.5 Rser=0.08 Lser=20n Rpar=40k Cpar=3p mfg="Nichicon" pn="UVZ1H682MRD" type="Al electrolytic"
SYMATTR Description Capacitor
SYMATTR Type cap
SYMBOL polcap 3344 -880 R90
WINDOW 0 0 32 VBottom 2
WINDOW 3 32 32 VTop 2
SYMATTR InstName C22
SYMATTR Value 6800µ
SYMATTR SpiceLine V=50 Irms=2.5 Rser=0.08 Lser=20n Rpar=40k Cpar=3p mfg="Nichicon" pn="UVZ1H682MRD" type="Al electrolytic"
SYMATTR Description Capacitor
SYMATTR Type cap
SYMBOL polcap 3632 -880 R90
WINDOW 0 0 32 VBottom 2
WINDOW 3 32 32 VTop 2
SYMATTR InstName C23
SYMATTR Value 6800µ
SYMATTR SpiceLine V=50 Irms=2.5 Rser=0.08 Lser=20n Rpar=40k Cpar=3p mfg="Nichicon" pn="UVZ1H682MRD" type="Al electrolytic"
SYMATTR Description Capacitor
SYMATTR Type cap
SYMBOL ind 3344 -848 R270
WINDOW 0 32 56 VTop 2
WINDOW 3 5 56 VBottom 2
SYMATTR InstName L3
SYMATTR Value 2n
SYMATTR SpiceLine Rser=1m
SYMBOL ind 3344 -752 R270
WINDOW 0 32 56 VTop 2
WINDOW 3 5 56 VBottom 2
SYMATTR InstName L7
SYMATTR Value 2n
SYMATTR SpiceLine Rser=1m
SYMBOL ind 3456 -848 R270
WINDOW 0 32 56 VTop 2
WINDOW 3 5 56 VBottom 2
SYMATTR InstName L8
SYMATTR Value 2n
SYMATTR SpiceLine Rser=1m
SYMBOL ind 3456 -752 R270
WINDOW 0 32 56 VTop 2
WINDOW 3 5 56 VBottom 2
SYMATTR InstName L9
SYMATTR Value 2n
SYMATTR SpiceLine Rser=1m
SYMBOL ind 3440 -880 R0
SYMATTR InstName L12
SYMATTR Value 2n
SYMATTR SpiceLine Rser=1m
SYMBOL res 432 48 R0
SYMATTR InstName R37
SYMATTR Value 240
SYMBOL res 2048 -784 R270
WINDOW 0 32 56 VTop 2
WINDOW 3 0 56 VBottom 2
SYMATTR InstName R51
SYMATTR Value 100k
SYMBOL res 2160 -624 R90
WINDOW 0 0 56 VBottom 2
WINDOW 3 32 56 VTop 2
SYMATTR InstName R62
SYMATTR Value 100k
SYMBOL diode 2144 -784 R0
WINDOW 3 17 -48 Left 2
SYMATTR Value MMSD4148
SYMATTR InstName D13
SYMBOL diode 2144 -688 R0
WINDOW 3 14 110 Left 2
SYMATTR Value MMSD4148
SYMATTR InstName D14
SYMBOL res 2240 -800 R0
WINDOW 3 45 -160 Invisible 2
SYMATTR Value {1+(10k*OFFSET)}
SYMATTR InstName POFFSET1
SYMBOL res 2240 -704 R0
WINDOW 3 49 222 Invisible 2
SYMATTR Value {1+(10k*(1-OFFSET))}
SYMATTR InstName POFFSET2
SYMBOL res 2448 -720 R90
WINDOW 0 0 56 VBottom 2
WINDOW 3 32 56 VTop 2
SYMATTR InstName R65
SYMATTR Value 1k
SYMBOL cap 2432 -624 M180
WINDOW 0 24 57 Left 2
WINDOW 3 24 8 Left 2
SYMATTR InstName C26
SYMATTR Value 22µ
SYMATTR SpiceLine V=50 Irms=90m Rser=2 Lser=2n Rpar=2meg Cpar=2p mfg="Panasonic" pn="ECEA1HN220U" type="Al bipolar"
SYMBOL res 2432 -816 R0
SYMATTR InstName R66
SYMATTR Value 22k
SYMBOL voltage 1792 -32 R90
WINDOW 0 -32 56 VBottom 2
WINDOW 3 32 56 Invisible 2
WINDOW 123 0 0 Left 2
WINDOW 39 0 0 Left 2
SYMATTR InstName V4
SYMATTR Value 0
SYMBOL voltage 2096 -32 R90
WINDOW 0 -32 56 VBottom 2
WINDOW 3 32 56 Invisible 2
WINDOW 123 0 0 Left 2
WINDOW 39 0 0 Left 2
SYMATTR InstName V6
SYMATTR Value 0
SYMBOL ind2 2864 -1328 R270
WINDOW 0 32 56 VTop 2
WINDOW 3 5 56 VBottom 2
SYMATTR InstName LGSPK1
SYMATTR Value {con1_len*20n}
SYMATTR SpiceLine Rser={con1_len*.5m}
SYMATTR Type ind
SYMBOL res 3088 -1360 R90
WINDOW 0 0 56 VBottom 2
WINDOW 3 32 56 VTop 2
SYMATTR InstName R78
SYMATTR Value 25m
SYMBOL ind2 2064 -1328 R270
WINDOW 0 32 56 VTop 2
WINDOW 3 5 56 VBottom 2
SYMATTR InstName LSPKN1
SYMATTR Value {con2_len*20n}
SYMATTR SpiceLine Rser={con2_len*.5m}
SYMATTR Type ind
SYMBOL res 2288 -1360 R90
WINDOW 0 0 56 VBottom 2
WINDOW 3 32 56 VTop 2
SYMATTR InstName R79
SYMATTR Value 25m
SYMBOL voltage -320 -528 R0
WINDOW 3 24 96 Invisible 2
WINDOW 123 0 0 Left 2
WINDOW 39 0 0 Left 2
SYMATTR Value SINE(0 {vinput/2} 19k)
SYMATTR InstName V9
SYMBOL voltage -320 -624 R0
WINDOW 3 24 96 Invisible 2
WINDOW 123 0 0 Left 2
WINDOW 39 0 0 Left 2
SYMATTR Value SINE(0 {vinput/2} 20k 0 0)
SYMATTR InstName V10
SYMBOL ind 1392 -1424 R270
WINDOW 0 32 56 VTop 2
WINDOW 3 5 56 VBottom 2
SYMATTR InstName L2
SYMATTR Value {20n+knfb}
SYMBOL ind 1392 -1520 R270
WINDOW 0 32 56 VTop 2
WINDOW 3 5 56 VBottom 2
SYMATTR InstName L13
SYMATTR Value {20n+knfb}
SYMBOL res 240 -720 R0
SYMATTR InstName R82
SYMATTR Value 5k1
SYMBOL polcap 144 -784 R0
SYMATTR InstName C30
SYMATTR Value 4µ7
SYMATTR SpiceLine V=63 Irms=2.77 Rser=0.036 Lser=5n Rpar=100k Cpar=3p
SYMATTR Description Capacitor
SYMATTR Type cap
SYMBOL ind2 1488 -144 R0
SYMATTR InstName L14
SYMATTR Value 40n
SYMATTR SpiceLine Rser=0.22 Cpar=3p
SYMATTR Type ind
SYMBOL ind2 1488 -32 R0
SYMATTR InstName L15
SYMATTR Value 40n
SYMATTR SpiceLine Rser=0.22 Cpar=3p
SYMATTR Type ind
SYMBOL npn 1440 -464 R0
SYMATTR InstName Q4
SYMATTR Value MJL3281A
SYMBOL pnp 1440 400 M180
SYMATTR InstName Q9
SYMATTR Value MJL1302A
SYMBOL res 1328 -432 R90
WINDOW 0 0 56 VBottom 2
WINDOW 3 32 56 VTop 2
SYMATTR InstName R5
SYMATTR Value 2
SYMBOL res 1328 336 R90
WINDOW 0 0 56 VBottom 2
WINDOW 3 32 56 VTop 2
SYMATTR InstName R68
SYMATTR Value 2
SYMBOL npn 192 400 R0
SYMATTR InstName Q14
SYMATTR Value CA_BC550C
SYMBOL cap 240 144 R90
WINDOW 0 0 32 VBottom 2
WINDOW 3 32 32 VTop 2
SYMATTR InstName C3
SYMATTR Value 180p
SYMATTR SpiceLine Rser=140m Lser=3n Rpar=7.4meg
SYMBOL res 240 -32 R0
SYMATTR InstName R7
SYMATTR Value 1k5
SYMBOL ind 1392 -1328 R270
WINDOW 0 32 56 VTop 2
WINDOW 3 5 56 VBottom 2
SYMATTR InstName L1
SYMATTR Value {20n+knfb}
SYMBOL res 1408 -1360 R90
WINDOW 0 0 56 VBottom 2
WINDOW 3 32 56 VTop 2
SYMATTR InstName R13
SYMATTR Value 3k9
SYMBOL cap 1296 -1360 R90
WINDOW 0 0 32 VBottom 2
WINDOW 3 32 32 VTop 2
SYMATTR InstName C9
SYMATTR Value 120p
SYMATTR SpiceLine Rser=140m Lser=3n Rpar=7.4meg
SYMBOL cap 48 912 M180
WINDOW 0 24 56 Left 2
WINDOW 3 24 8 Left 2
SYMATTR InstName C13
SYMATTR Value 22p
SYMATTR SpiceLine Rser=140m Lser=3n Rpar=7.4meg
SYMBOL res 48 448 R0
SYMATTR InstName R14
SYMATTR Value 680
SYMBOL npn 576 688 R0
SYMATTR InstName Q15
SYMATTR Value BC846B
SYMBOL res 912 -224 R0
SYMATTR InstName R8
SYMATTR Value 120
SYMBOL res 912 48 R0
SYMATTR InstName R11
SYMATTR Value 120
SYMBOL polcap 912 -16 R0
SYMATTR InstName C19
SYMATTR Value 10µ
SYMATTR SpiceLine V=100 Irms=250m Rser=0.71 Lser=2n Rpar=2meg Cpar=2p
SYMATTR Description Capacitor
SYMATTR Type cap
SYMBOL res -48 -720 R0
SYMATTR InstName R45
SYMATTR Value 15k
SYMBOL npn -192 688 R0
SYMATTR InstName Q6
SYMATTR Value BC846B
SYMBOL npn -256 688 M0
SYMATTR InstName Q8
SYMATTR Value BC846B
SYMBOL res 448 -912 R90
WINDOW 0 0 56 VBottom 2
WINDOW 3 32 56 VTop 2
SYMATTR InstName R15
SYMATTR Value 1k
SYMBOL res -112 -912 R90
WINDOW 0 0 56 VBottom 2
WINDOW 3 32 56 VTop 2
SYMATTR InstName R44
SYMATTR Value 1k
SYMBOL pnp 320 -848 R180
WINDOW 0 77 84 Left 2
WINDOW 3 75 52 Left 2
SYMATTR InstName Q5
SYMATTR Value CA_BC560C
SYMBOL pnp -96 -848 M180
WINDOW 0 77 84 Left 2
WINDOW 3 75 52 Left 2
SYMATTR InstName Q10
SYMATTR Value CA_BC560C
TEXT -48 -1488 Left 2 !;op
TEXT -752 -1344 Left 2 !.option plotwinsize=0
TEXT -752 -1312 Left 2 !.option noopiter
TEXT -752 -1616 Left 2 ;Transient
TEXT -752 -1456 Left 2 !.four {freq} 10 10 v(SPK+,SPK-)
TEXT -48 -1520 Left 2 !.param prb=0
TEXT -752 -1520 Left 2 !.param timestep {1/((262144/8)*freq)}
TEXT -752 -1552 Left 2 !.param freq 20k
TEXT -752 -1488 Left 2 !.param stoptime {iterations/freq}
TEXT -48 -1584 Left 2 !;ac oct 100 10 100meg
TEXT -48 -1552 Left 2 ;.step param prb list -1 1
TEXT -48 -1616 Left 2 ;AC analysis
TEXT -752 -1424 Left 2 !.param iterations 80
TEXT -416 -1280 Left 2 !.lib user/ONNN_BJT.lib
TEXT -48 -1280 Left 2 !.param Zimp 6
TEXT 1920 -1120 Left 2 !.param Zreal Zimp/2
TEXT 1920 -1088 Left 2 !.param Zimg (Zimp*sqrt(3))/(4*pi*freq)
TEXT -48 -1248 Left 2 !.param supplyPWR 100
TEXT -48 -1216 Left 2 !.param supplyVLT 24
TEXT -416 -1216 Left 2 !.lib user/STM_D.lib
TEXT -416 -1312 Left 2 !.lib user/FCS_BJT.lib
TEXT -48 -1312 Left 2 !.param voutput 25
TEXT -48 -1184 Left 2 !.param supplyK 0.06
TEXT 2704 -448 Left 2 !.param rser {(supplyVLT*supplyVLT*supplyK)/(2*supplyPWR)}
TEXT -752 -1584 Left 2 !.tran 0 {stoptime} 0 {timestep}
TEXT 2704 -416 Left 2 !.param phi 90
TEXT 304 -1312 Left 2 !.param con1_len 15
TEXT 2704 -480 Left 2 !KCON1 LVCC LSGND LGSPK1 LGSPK2 LPGND LPWRGND1 LPWRGND2 LVEE LDGND 0.8
TEXT 304 -1280 Left 2 !.param con2_len 15
TEXT 1920 -1152 Left 2 !KCON2 LSPKP LOUTR LSPKN1 LSPKN2 0.8
TEXT 2288 -272 Left 2 !KOTR LTRF LTRR 0.9
TEXT 1904 -1616 Left 2 ;Konektor zvucnika i zvucnik
TEXT 2672 -1616 Left 2 ;Konektor napajanja, star ground i napajanje
TEXT 688 -1616 Left 2 ;Negativna povratna sprega
TEXT 2672 -304 Left 2 ;Napajanje digitalnog dela, indikatori preopterecenja i klipinga
TEXT -48 -1344 Left 2 ;Ulazni parametri kola
TEXT 2288 -304 Left 2 ;Izlazni transformator
TEXT 2464 80 Center 2 ;AC sonda
TEXT 3464 -1048 Left 2 ;Masa digitalnog \ndela dolazi sa \nupravljacke ploce.
TEXT -416 -1344 Left 2 !.lib user/FCS_D.lib
TEXT 304 -1248 Left 2 !.param BIAS 0.49
TEXT 304 -1216 Left 2 !.param OFFSET 0.49
TEXT 1904 -976 Left 2 ;Kolo za ponistavanje offset-a
TEXT -416 -1248 Left 2 !.lib user/ONNN_D.lib
TEXT 1328 -1176 Left 2 !.param knfb 1p
TEXT 688 -1176 Left 2 !.param vinput voutput*(nfb1/nfb2)
TEXT -48 -1152 Left 2 !.param nfb1 100
TEXT -48 -1120 Left 2 !.param nfb2 1k8
TEXT 968 -384 Left 2 ;Imax=15A\nI=7A @ DC
TEXT -416 -1184 Left 2 !.lib user/TSE_BJT.lib
RECTANGLE Normal -96 -1632 -768 -1392
RECTANGLE Normal -96 -1152 -768 -1360
RECTANGLE Normal 608 -1632 -64 -1392
RECTANGLE Normal 608 -1088 -64 -1360
RECTANGLE Normal 3840 -384 2656 -1632 2
RECTANGLE Normal 2592 -1056 1888 -1632 2
RECTANGLE Normal 3840 768 2656 -320 2
RECTANGLE Normal 2592 -256 2272 -320 2
RECTANGLE Normal 2288 16 2160 -176 2
RECTANGLE Normal 2592 544 2336 64 2
RECTANGLE Normal 3088 -720 2864 -1584 2
RECTANGLE Normal 2288 -1200 2064 -1584 2
RECTANGLE Normal 2368 16 2288 -176 2
RECTANGLE Normal 1504 -1296 1392 -1584 2
RECTANGLE Normal 1824 -1152 672 -1632 2
RECTANGLE Normal 2592 -384 1888 -992 2

The netlist it stands for:
* Arguo v2.asc
R12 nfb offset {nfb1}
V2 N041 0 SINE(0 {supplyVLT*sqrt(2)} 50 0 0 {phi}) Rser={rser}
Ii xp x 0 AC {u(prb)}
Vi x AC2 0 AC {u(-prb)}
Q11 vas_in N063 N060 0 CA_BC560C
R33 N063 N058 {nfb1}
R34 N063 sgnd {nfb2}
R2 N088 N091 110
R3 N089 N091 110
R9 vcm N060 100
R10 vcm N061 100
R16 vcc+ N026 36
Q12 N043 N033 N026 0 2SA1381F
D7 preout vcc+ 1N5404
D8 vcc- preout 1N5404
LTRF out1 N057 2µ Rser=10m Rpar=3meg Cpar=1p
R19 out1 N057 2.2
R20 N004 nfb {nfb2}
V1 x AC1 0
D6 N041 N003 GBPC3502
D9 N028 N042 GBPC3502
V3 0 N042 SINE(0 {supplyVLT*sqrt(2)} 50 0 0 {phi}) Rser={rser}
R54 out1 N067 10
R60 SPK+ N013 {Zreal}
L19 N013 SPK- {Zimg} Cpar=10p
V18 xp pwrgnd 0
Q17 vcc- N081 N066 0 CA_MJE15033C
Q18 vcc+ N048 N049 0 CA_MJE15032C
C20 vcc+ pwrgnd 100n Rser=700m Lser=7n Rpar=4.4meg Cpar=1p
R27 N048 N047 2
R30 N081 N070 2
R24 N084 N091 510
C24 N067 pwrgnd 100n Rser=700m Lser=7n Rpar=4.4meg Cpar=1p
C25 pwrgnd vcc- 100n Rser=700m Lser=7n Rpar=4.4meg Cpar=1p
C2 offset sgnd 2200µ V=6.3 Irms=1.44 Rser=0.09 Lser=5.5n Rpar=110k Cpar=3p mfg="Nichicon" pn="UPW0J222MPD6TD" type="Al electrolytic"
C6 N036 N028 6800µ V=50 Irms=2.5 Rser=0.08 Lser=20n Rpar=40k Cpar=3p mfg="Nichicon" pn="UVZ1H682MRD" type="Al electrolytic"
R21 dvcc N075 10k
Q23 N075 dgnd prot 0 BC846B
R47 vcc+ N023 100
Q2 protection N076 dvcc 0 BC856B
R48 protection dgnd 10k
R49 N076 N075 1k
R§PBIAS1 N054 N064 {1+(500*BIAS)}
R52 N043 N054 1k2
R53 N047 N043 11
D10 N042 N003 GBPC3502
D11 N028 N041 GBPC3502
LVCC vcc+ N002 {con1_len*20n} Rser={con1_len*.5m}
LVEE vcc- N035 {con1_len*20n} Rser={con1_len*.5m}
D2 vas_in N070 BAV21
D16 offset N009 BAV21
D17 N009 sgnd BAV21
D18 sgnd N016 BAV21
D19 N016 offset BAV21
R46 out1 N005 100
LTRR out2 N055 2µ Rser=80m Rpar=3meg Cpar=1p
Q34 N079 N080 N082 0 CA_2N5551C
R70 N080 vcc- 12k
R71 out1 N080 39k
R72 N073 N079 39k
D21 out1 N073 MMSD4148
R73 N062 N073 39k
R74 vcc+ N062 12k
Q35 N068 N062 N059 0 CA_2N5401C
R75 N068 N074 47k
Q36 clip N074 dgnd 0 BC846B
R76 N074 dgnd 4k7
R77 dvcc clip 4k7
Q37 vcc- vcc- N082 0 CA_2N5401C
Q38 vcc+ vcc+ N059 0 CA_2N5551C
Q3 N070 N084 N086 0 2SC3503F
R6 N086 N091 18
C4 sgnd N063 4n7
V11 sinus sgnd SINE(0 {vinput} {freq})
Q13 vas_in N085 N091 0 BC846B
R63 N086 N085 1k
R64 N087 N086 1k
R4 N033 N038 10k
R1 N049 N066 33
Q1 vcm N032 N023 0 2SA1381F
Q7 N083 nfb N061 0 CA_BC560C
Q21 N047 N054 N070 0 MJE340
C1 N049 N066 220n Rser=30m Lser=3n Rpar=700k
C5 N070 N069 180p Rser=140m Lser=3n Rpar=7.4meg
R17 vcc- N091 22
LGSPK2 gspk N018 {con1_len*20n} Rser={con1_len*.5m}
LPWRGND2 pwrgnd N022 {con1_len*20n} Rser={con1_len*.5m}
LPGND pgnd N019 {con1_len*20n} Rser={con1_len*.5m}
LSGND sgnd N007 {con1_len*20n} Rser={con1_len*.5m}
R18 N003 N002 25m
R26 N015 N018 25m
R28 dgnd N022 25m
R29 N020 N019 25m
R32 N008 N007 25m
R38 N028 N035 25m
L4 dgnd N030 2n Rser=1m
L5 N020 dgnd 2n Rser=1m
L6 N015 N020 2n Rser=1m
L18 N008 N015 2n Rser=1m
LSPKP SPKP N001 {con2_len*20n} Rser={con2_len*.5m}
LOUTR SPKE N006 {con2_len*20n} Rser={con2_len*.5m}
LSPKN2 gspk N017 {con2_len*20n} Rser={con2_len*.5m}
R35 SPKE N055 20m
R39 SPKP N057 20m
R41 SPK+ N001 25m
R42 SPK+ N006 25m
R43 SPK- N017 25m
LDGND pwrgnd N027 {con1_len*20n} Rser={con1_len*.5m}
R31 dgnd N027 25m
C7 dvcc dgnd 220µ Rser=100m Lser=50n Rpar=100k Cpar=3p
V5 dvcc dgnd 5 Rser=10
LPWRGND1 pwrgnd N021 {con1_len*20n} Rser={con1_len*.5m}
R25 dgnd N021 25m
C10 pwrgnd N091 100n Rser=700m Lser=7n Rpar=4.4meg Cpar=1p
V7 N045 sgnd PULSE(0 {vinput/2} 1u 1n 1n {1/(freq*2)} {1/freq})
V8 impulse N045 PULSE(0 {-vinput/2} {1u+(1/(freq*2))} 1n 1n {1/(freq*2)} {1/freq})
Q22 N051 N052 preout 0 BC846B
Q24 N078 N071 preout 0 BC856B
D4 N078 N070 MMSD4148
D5 N047 N051 MMSD4148
R36 N052 preout 240
R40 preout N071 240
R56 N072 N071 240
R58 N053 N052 240
C18 N056 preout 10µ V=100 Irms=250m Rser=0.71 Lser=2n Rpar=2meg Cpar=2p
C11 N058 sinus 220µ V=6.3 Irms=290m Rser=0.5 Lser=3n Rpar=100k Cpar=3p mfg="Nichicon" pn="UPW0J221MED1TD" type="Al electrolytic"
C12 pwrgnd N091 220µ V=6.3 Irms=290m Rser=0.5 Lser=3n Rpar=100k Cpar=3p mfg="Nichicon" pn="UPW0J221MED1TD" type="Al electrolytic"
C14 vcc+ pwrgnd 1000µ V=63 Irms=2.77 Rser=0.036 Lser=5n Rpar=100k Cpar=3p mfg="Nichicon" pn="UPW1J102MHD6" type="Al electrolytic"
C17 pwrgnd vcc- 1000µ V=63 Irms=2.77 Rser=0.036 Lser=5n Rpar=100k Cpar=3p mfg="Nichicon" pn="UPW1J102MHD6" type="Al electrolytic"
C21 N047 N070 22µ V=100 Irms=250m Rser=0.71 Lser=2n Rpar=2meg Cpar=2p mfg="Nichicon" pn="UPW1J220MED" type="Al electrolytic"
C16 N003 N037 6800µ V=50 Irms=2.5 Rser=0.08 Lser=20n Rpar=40k Cpar=3p mfg="Nichicon" pn="UVZ1H682MRD" type="Al electrolytic"
C22 N029 N028 6800µ V=50 Irms=2.5 Rser=0.08 Lser=20n Rpar=40k Cpar=3p mfg="Nichicon" pn="UVZ1H682MRD" type="Al electrolytic"
C23 N003 N031 6800µ V=50 Irms=2.5 Rser=0.08 Lser=20n Rpar=40k Cpar=3p mfg="Nichicon" pn="UVZ1H682MRD" type="Al electrolytic"
L3 N029 N030 2n Rser=1m
L7 N036 0 2n Rser=1m
L8 N030 N031 2n Rser=1m
L9 0 N037 2n Rser=1m
L12 N030 0 2n Rser=1m
R37 N064 N070 240
R51 vcc+ N034 100k
R62 N044 vcc- 100k
D13 N034 sgnd MMSD4148
D14 sgnd N044 MMSD4148
R§POFFSET1 N034 N039 {1+(10k*OFFSET)}
R§POFFSET2 N039 N044 {1+(10k*(1-OFFSET))}
R65 N040 N039 1k
C26 sgnd N040 22µ V=50 Irms=90m Rser=2 Lser=2n Rpar=2meg Cpar=2p mfg="Panasonic" pn="ECEA1HN220U" type="Al bipolar"
R66 offset N040 22k
V4 AC1 preout 0
V6 out1 AC2 0
LGSPK1 gspk N014 {con1_len*20n} Rser={con1_len*.5m}
R78 N015 N014 25m
LSPKN1 gspk N012 {con2_len*20n} Rser={con2_len*.5m}
R79 SPK- N012 25m
V9 N046 sgnd SINE(0 {vinput/2} 19k)
V10 imd N046 SINE(0 {vinput/2} 20k 0 0)
L2 N004 N005 {20n+knfb}
L13 N004 out2 {20n+knfb}
R82 N038 pgnd 5k1
C30 vcc+ N038 4µ7 V=63 Irms=2.77 Rser=0.036 Lser=5n Rpar=100k Cpar=3p
L14 N053 preout 40n Rser=0.22 Cpar=3p
L15 preout N072 40n Rser=0.22 Cpar=3p
Q4 vcc+ N050 N053 0 MJL3281A
Q9 vcc- N077 N072 0 MJL1302A
R5 N050 N049 2
R68 N077 N066 2
Q14 pgnd vas_in N084 0 CA_BC550C
C3 N069 vas_in 180p Rser=140m Lser=3n Rpar=7.4meg
R7 sgnd N069 1k5
L1 N011 preout {20n+knfb}
R13 N011 N010 3k9
C9 N010 nfb 120p Rser=140m Lser=3n Rpar=7.4meg
C13 N091 N090 22p Rser=140m Lser=3n Rpar=7.4meg
R14 vas_in N090 680
Q15 prot N087 N091 0 BC846B
R8 N052 N056 120
R11 N065 N071 120
C19 preout N065 10µ V=100 Irms=250m Rser=0.71 Lser=2n Rpar=2meg Cpar=2p
R45 N032 pgnd 15k
Q6 N083 N083 N089 0 BC846B
Q8 vas_in N083 N088 0 BC846B
R15 N026 N025 1k
R44 N024 N023 1k
Q5 N033 N025 vcc+ 0 CA_BC560C
Q10 N032 N024 vcc+ 0 CA_BC560C
.model D D
.lib standard.dio
.model NPN NPN
.model PNP PNP
.lib standard.bjt
;op
.option plotwinsize=0
.option noopiter
* Transient
.four {freq} 10 10 v(SPK+,SPK-)
.param prb=0
.param timestep {1/((262144/8)*freq)}
.param freq 20k
.param stoptime {iterations/freq}
;ac oct 100 10 100meg
* .step param prb list -1 1
* AC analysis
.param iterations 80
.lib user/ONNN_BJT.lib
.param Zimp 6
.param Zreal Zimp/2
.param Zimg (Zimp*sqrt(3))/(4*pi*freq)
.param supplyPWR 100
.param supplyVLT 24
.lib user/STM_D.lib
.lib user/FCS_BJT.lib
.param voutput 25
.param supplyK 0.06
.param rser {(supplyVLT*supplyVLT*supplyK)/(2*supplyPWR)}
.tran 0 {stoptime} 0 {timestep}
.param phi 90
.param con1_len 15
KCON1 LVCC LSGND LGSPK1 LGSPK2 LPGND LPWRGND1 LPWRGND2 LVEE LDGND 0.8
.param con2_len 15
KCON2 LSPKP LOUTR LSPKN1 LSPKN2 0.8
KOTR LTRF LTRR 0.9
* Konektor zvucnika i zvucnik
* Konektor napajanja, star ground i napajanje
* Negativna povratna sprega
* Napajanje digitalnog dela, indikatori preopterecenja i klipinga
* Ulazni parametri kola
* Izlazni transformator
* AC sonda
* Masa digitalnog
* dela dolazi sa
* upravljacke ploce.
.lib user/FCS_D.lib
.param BIAS 0.49
.param OFFSET 0.49
* Kolo za ponistavanje offset-a
.lib user/ONNN_D.lib
.param knfb 1p
.param vinput voutput*(nfb1/nfb2)
.param nfb1 100
.param nfb2 1k8
* Imax=15A
* I=7A @ DC
.lib user/TSE_BJT.lib
.backanno
.end